# Altium project realPlantNursery.PrjPcb
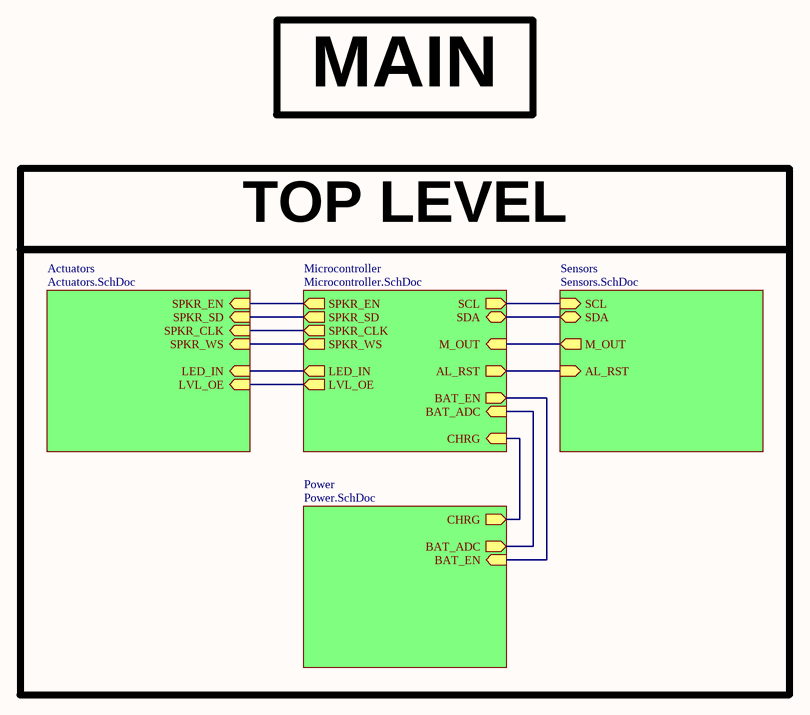
[diagram p0: Main.SchDoc]
5 sheets, 75 parts. Net scope: hierarchical (ports join the sheet entries above them; power ports are global).
Sheets:
  Main.SchDoc
    Microcontroller = Microcontroller.SchDoc
    Sensors = Sensors.SchDoc
    Actuators = Actuators.SchDoc
    Power = Power.SchDoc

## Sheet Main.SchDoc
size A; DocumentNumber: 1; SheetNumber: 1; SheetTotal: 5

### Parts
LOGO  SM Logo  [logo_10]  (value not drawn)  (no BOM)

### Sub-sheets
Actuators = Actuators.SchDoc: SPKR_EN (in), SPKR_SD (in), SPKR_CLK (in), SPKR_WS (in), LED_IN (in), LVL_OE (in)
Microcontroller = Microcontroller.SchDoc: SCL (out), SDA, M_OUT (in), CHRG (in), LVL_OE (out), LED_IN (out), SPKR_EN (out), SPKR_SD (out), SPKR_CLK (out), SPKR_WS (out), AL_RST (out), BAT_ADC (in), BAT_EN (out)
Power = Power.SchDoc: CHRG (out), BAT_ADC (out), BAT_EN (in)
Sensors = Sensors.SchDoc: SCL (in), SDA, AL_RST (in), M_OUT (out)

### Nets
AL_RST: sheet Microcontroller/AL_RST, sheet Sensors/AL_RST
BAT_ADC: sheet Microcontroller/BAT_ADC, sheet Power/BAT_ADC
BAT_EN: sheet Microcontroller/BAT_EN, sheet Power/BAT_EN
CHRG: sheet Microcontroller/CHRG, sheet Power/CHRG
LED_IN: sheet Microcontroller/LED_IN, sheet Actuators/LED_IN
LVL_OE: sheet Microcontroller/LVL_OE, sheet Actuators/LVL_OE
M_OUT: sheet Microcontroller/M_OUT, sheet Sensors/M_OUT
SCL: sheet Microcontroller/SCL, sheet Sensors/SCL
SDA: sheet Microcontroller/SDA, sheet Sensors/SDA
SPKR_CLK: sheet Microcontroller/SPKR_CLK, sheet Actuators/SPKR_CLK
SPKR_EN: sheet Microcontroller/SPKR_EN, sheet Actuators/SPKR_EN
SPKR_SD: sheet Microcontroller/SPKR_SD, sheet Actuators/SPKR_SD
SPKR_WS: sheet Microcontroller/SPKR_WS, sheet Actuators/SPKR_WS

### Notes on the sheet
- MAIN
- TOP LEVEL

### Library data of the parts
LOGO = smLogo

## Sheet Microcontroller.SchDoc
size A; DocumentNumber: 2; SheetNumber: 2; SheetTotal: 5
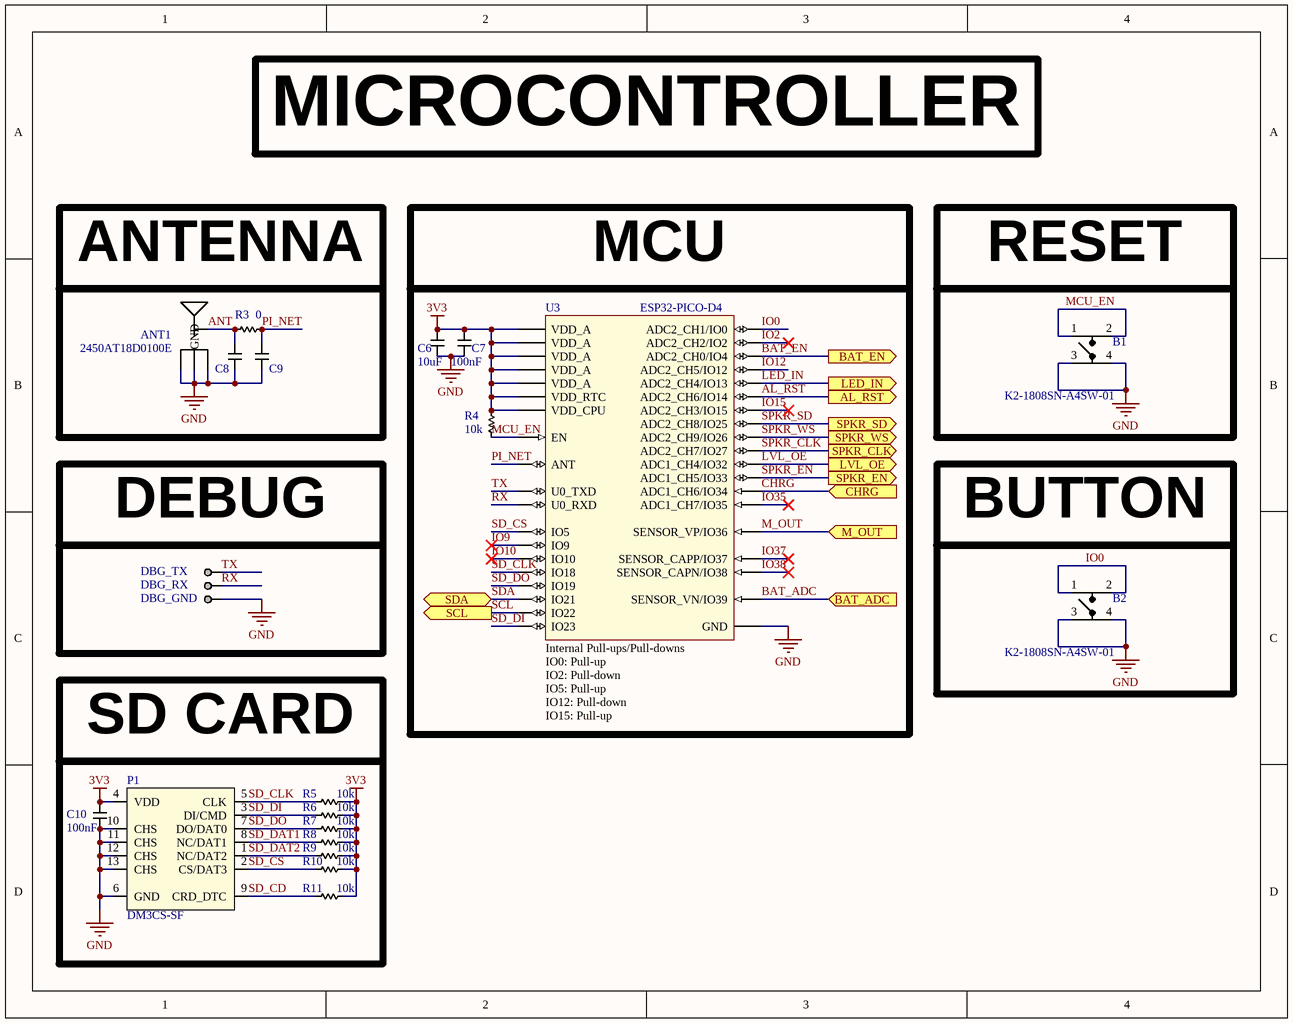
[diagram p1: Microcontroller.SchDoc]

### Parts
ANT1  2450AT18D0100E  [2450AT18D0100E_RH]
B1  K2-1808SN-A4SW-01  [K2-1808SN-A4SW-01]
B2  K2-1808SN-A4SW-01  [K2-1808SN-A4SW-01]
C6  10uF  [CAP_0603_HIGH]
C7  100nF  [CAP_0402_HIGH]
C8  C  [CAP_0402_HIGH]  (value not drawn)  (no BOM)
C9  C  [CAP_0402_HIGH]  (value not drawn)  (no BOM)
C10  100nF  [CAP_0402_HIGH]
DBG_GND  0.1" Header  [0.1" Header]  (value not drawn)  (no BOM)
DBG_RX  0.1" Header  [0.1" Header]  (value not drawn)  (no BOM)
DBG_TX  0.1" Header  [0.1" Header]  (value not drawn)  (no BOM)
P1  DM3CS-SF  [DM3CS-SF]
R3  0  [RES_0402_HIGH]
R4  10k  [RES_0402_HIGH]
R5  10k  [RES_0402_HIGH]
R6  10k  [RES_0402_HIGH]
R7  10k  [RES_0402_HIGH]
R8  10k  [RES_0402_HIGH]
R9  10k  [RES_0402_HIGH]
R10  10k  [RES_0402_HIGH]
R11  10k  [RES_0402_HIGH]
U3  ESP32-PICO-D4  [ESP32-PICO-D4]

### Ports
AL_RST (out), BAT_ADC (in), BAT_EN (out), CHRG (in), LED_IN (out), LVL_OE (out), M_OUT (in), SCL (out), SDA, SPKR_CLK (out), SPKR_EN (out), SPKR_SD (out), SPKR_WS (out)

### Nets
3V3: C6.2 C7.2 C10.2 P1.4(VDD) R4.2 R5.1 R6.1 R7.1 R8.1 R9.1 R10.1 R11.1 U3.1(VDD_A) U3.3(VDD_A) U3.4(VDD_A) U3.19(VDD_RTC) U3.37(VDD_CPU) U3.43(VDD_A) U3.46(VDD_A)
GND: ANT1.2(GND) ANT1.3(GND) ANT1.4(GND) B1.3 B1.4 B2.3 B2.4 C6.1 C7.1 C8.1 C9.1 C10.1 DBG_GND.1 P1.6(GND) P1.10(CHS) P1.11(CHS) P1.12(CHS) P1.13(CHS) U3.49(GND)
AL_RST: U3.17(ADC2_CH6/IO14) ; port AL_RST
ANT: ANT1.1(FEED) C8.2 R3.1
BAT_ADC: U3.8(SENSOR_VN/IO39) ; port BAT_ADC
BAT_EN: U3.24(ADC2_CH0/IO4) ; port BAT_EN
CHRG: U3.10(ADC1_CH6/IO34) ; port CHRG
IO0: B2.1 B2.2 U3.23(ADC2_CH1/IO0)
IO2: U3.22(ADC2_CH2/IO2)
IO9: U3.28(IO9)
IO10: U3.29(IO10)
IO12: U3.18(ADC2_CH5/IO12)
IO15: U3.21(ADC2_CH3/IO15)
IO35: U3.11(ADC1_CH7/IO35)
IO37: U3.6(SENSOR_CAPP/IO37)
IO38: U3.7(SENSOR_CAPN/IO38)
LED_IN: U3.20(ADC2_CH4/IO13) ; port LED_IN
LVL_OE: U3.12(ADC1_CH4/IO32) ; port LVL_OE
M_OUT: U3.5(SENSOR_VP/IO36) ; port M_OUT
MCU_EN: B1.1 B1.2 R4.1 U3.9(EN)
PI_NET: C9.2 R3.2 U3.2(ANT)
RX: DBG_RX.1 U3.40(U0_RXD)
SCL: U3.39(IO22) ; port SCL
SD_CD: P1.9(CRD_DTC) R11.2
SD_CLK: P1.5(CLK) R5.2 U3.35(IO18)
SD_CS: P1.2(CS/DAT3) R10.2 U3.34(IO5)
SD_DAT1: P1.8(NC/DAT1) R8.2
SD_DAT2: P1.1(NC/DAT2) R9.2
SD_DI: P1.3(DI/CMD) R6.2 U3.36(IO23)
SD_DO: P1.7(DO/DAT0) R7.2 U3.38(IO19)
SDA: U3.42(IO21) ; port SDA
SPKR_CLK: U3.16(ADC2_CH7/IO27) ; port SPKR_CLK
SPKR_EN: U3.13(ADC1_CH5/IO33) ; port SPKR_EN
SPKR_SD: U3.14(ADC2_CH8/IO25) ; port SPKR_SD
SPKR_WS: U3.15(ADC2_CH9/IO26) ; port SPKR_WS
TX: DBG_TX.1 U3.41(U0_TXD)

### Notes on the sheet
- MICROCONTROLLER
- ANTENNA
- MCU
- (near B1) RESET
- DEBUG
- (near B2) BUTTON
- SD CARD
- (in symbol ESP32-PICO-D4) Internal Pull-ups/Pull-downs / IO0: Pull-up / IO2: Pull-down / IO5: Pull-up / IO12: Pull-down / IO15: Pull-up /

### Library data of the parts
ANT1 = 2450AT18D0100E_RH: 2450AT18D0100E 2.4GHz  Chip RF Antenna 2.4GHz ~ 2.5GHz 1.5dBi Solder Surface Mount
B1 B2 = K2-1808SN-A4SW-01: K2-1808SN-A4SW-01 Tactile Switch SPST-NO Top Actuated Surface Mount
C6 = Capacitor_0603: 0603 Capacitor
C7-C10 = Capacitor_0402: 0402 Capacitor
P1 = DM3CS-SF: DM3CS-SF 10 (8 + 2) Position Card Connector Secure Digital - microSD™ Surface Mount, Right Angle Gold
R3-R11 = Resistor_0402: 0402 Resistor
U3 = ESP32-PICO-D4: ESP32-PICO-D4 SoC

## Sheet Sensors.SchDoc
size A; DocumentNumber: 3; SheetNumber: 3; SheetTotal: 5
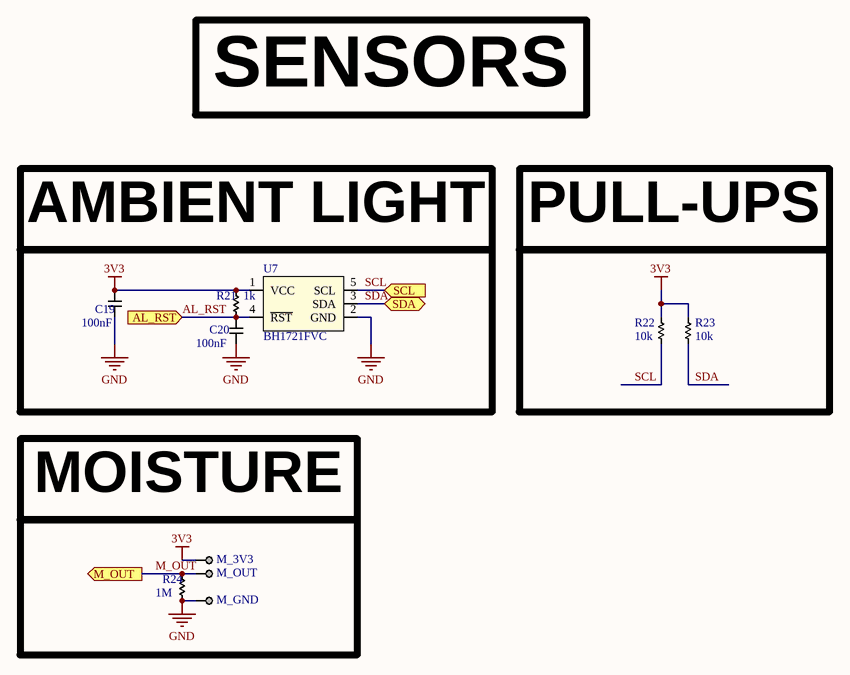
[diagram p2: Sensors.SchDoc]

### Parts
C19  100nF  [CAP_0402_HIGH]
C20  100nF  [CAP_0402_HIGH]
M_3V3  0.1" Header  [0.1" Header]  (value not drawn)  (no BOM)
M_GND  0.1" Header  [0.1" Header]  (value not drawn)  (no BOM)
M_OUT  0.1" Header  [0.1" Header]  (value not drawn)  (no BOM)
R21  1k  [RES_0402_HIGH]
R22  10k  [RES_0402_HIGH]
R23  10k  [RES_0402_HIGH]
R24  1M  [RES_0402_HIGH]
U7  BH1721FVC  [BH1721FVC]

### Ports
AL_RST (in), M_OUT (out), SCL (in), SDA

### Nets
3V3: C19.2 M_3V3.1 R21.2 R22.2 R23.2 U7.1(VCC)
GND: C19.1 C20.1 M_GND.1 R24.1 U7.2(GND)
AL_RST: C20.2 R21.1 U7.4(~{RST}) ; port AL_RST
M_OUT: M_OUT.1 R24.2 ; port M_OUT
SCL: R22.1 U7.5(SCL) ; port SCL
SDA: R23.1 U7.3(SDA) ; port SDA

### Notes on the sheet
- SENSORS
- AMBIENT LIGHT
- PULL-UPS
- MOISTURE

### Library data of the parts
C19 C20 = Capacitor_0402: 0402 Capacitor
R21-R24 = Resistor_0402: 0402 Resistor
U7 = BH1721FVC: BH1721FVC Optical Sensor Ambient 560nm I²C 5-SMD, Flat Leads

## Sheet Actuators.SchDoc
size A; DocumentNumber: 4; SheetNumber: 4; SheetTotal: 5
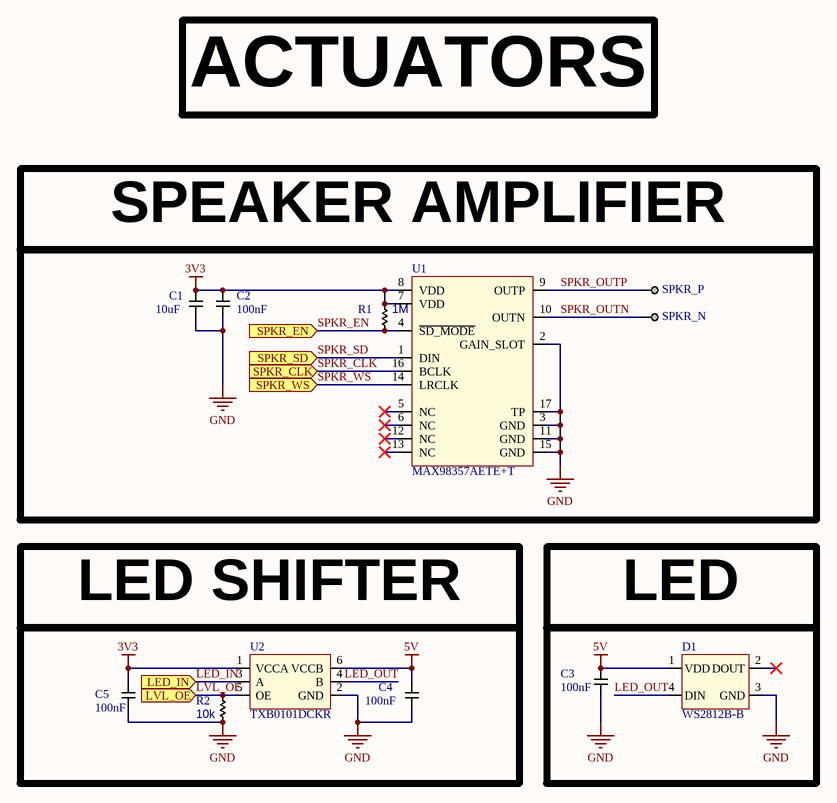
[diagram p3: Actuators.SchDoc]

### Parts
C1  10uF  [CAP_0603_HIGH]
C2  100nF  [CAP_0402_HIGH]
C3  100nF  [CAP_0402_HIGH]
C4  100nF  [CAP_0402_HIGH]
C5  100nF  [CAP_0402_HIGH]
D1  WS2812B-B  [WS2812B-B]
R1  1M  [RES_0402_HIGH]
R2  10k  [RES_0402_HIGH]
SPKR_N  0.1" Header  [0.1" Header]  (value not drawn)  (no BOM)
SPKR_P  0.1" Header  [0.1" Header]  (value not drawn)  (no BOM)
U1  MAX98357AETE+T  [MAX98357AETE+T]
U2  TXB0101DCKR  [TXB0101DCKR]

### Ports
LED_IN (in), LVL_OE (in), SPKR_CLK (in), SPKR_EN (in), SPKR_SD (in), SPKR_WS (in)

### Nets
3V3: C1.2 C2.2 C5.2 R1.2 U1.7(VDD) U1.8(VDD) U2.1(VCCA)
5V: C3.2 C4.2 D1.1(VDD) U2.6(VCCB)
GND: C1.1 C2.1 C3.1 C4.1 C5.1 D1.3(GND) R2.1 U1.2(GAIN_SLOT) U1.3(GND) U1.11(GND) U1.15(GND) U1.17(TP) U2.2(GND)
LED_IN: U2.3(A) ; port LED_IN
LED_OUT: D1.4(DIN) U2.4(B)
LVL_OE: R2.2 U2.5(OE) ; port LVL_OE
SPKR_CLK: U1.16(BCLK) ; port SPKR_CLK
SPKR_EN: R1.1 U1.4(~{SD_MODE}) ; port SPKR_EN
SPKR_OUTN: SPKR_N.1 U1.10(OUTN)
SPKR_OUTP: SPKR_P.1 U1.9(OUTP)
SPKR_SD: U1.1(DIN) ; port SPKR_SD
SPKR_WS: U1.14(LRCLK) ; port SPKR_WS

Not connected (* = marked no-connect by the designer): D1 2(DOUT)*; U1 5(NC)* 6(NC)* 12(NC)* 13(NC)*

### Notes on the sheet
- ACTUATORS
- SPEAKER AMPLIFIER
- LED SHIFTER
- LED

### Library data of the parts
C1 = Capacitor_0603: 0603 Capacitor
C2-C5 = Capacitor_0402: 0402 Capacitor
D1 = WS2812B-B: WS2812B-B RGB 620~630nm Red, 515~530nm Green, 465~475nm Blue SMD,5x5mm Light Emitting Diodes (LED) ROHS
R1 R2 = Resistor_0402: 0402 Resistor
U1 = MAX98357AETE+T: MAX98357AETE+T Amplifier IC 1-Channel (Mono) Class D 16-TQFN (3x3)
U2 = TXB0101DCKR: TXB0101DCKR Voltage Level Translator Bidirectional 1 Circuit 1 Channel 100Mbps SC-70-6

## Sheet Power.SchDoc
size A; DocumentNumber: 5; SheetNumber: 5; SheetTotal: 5
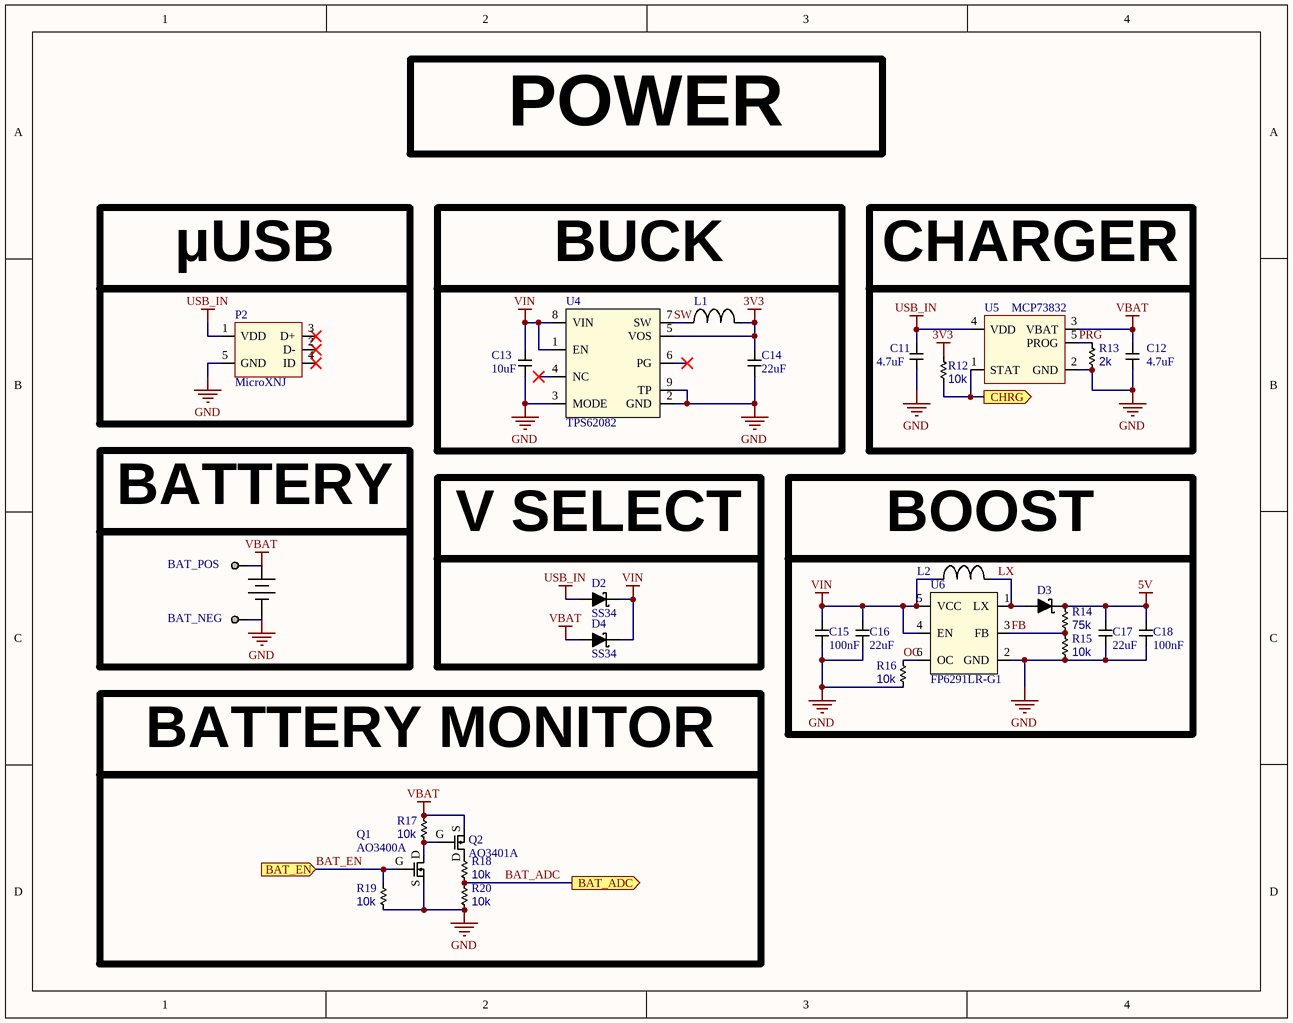
[diagram p4: Power.SchDoc]

### Parts
BAT_NEG  18 AWG Hole  [18 AWG Hole]  (value not drawn)  (no BOM)
BAT_POS  18 AWG Hole  [18 AWG Hole]  (value not drawn)  (no BOM)
C11  4.7uF  [CAP_0402_HIGH]
C12  4.7uF  [CAP_0402_HIGH]
C13  10uF  [CAP_0603_HIGH]
C14  22uF  [CAP_0603_HIGH]
C15  100nF  [CAP_0402_HIGH]
C16  22uF  [CAP_0603_HIGH]
C17  22uF  [CAP_0603_HIGH]
C18  100nF  [CAP_0402_HIGH]
D2  SS34  [SS34]
D3  SS34  [SS34]  (value not drawn)
D4  SS34  [SS34]
L1  YNR3015-2R2M  [YNR3015-2R2M]  (value not drawn)
L2  VLS3015ET-3R3M  [VLS3015ET-3R3M]  (value not drawn)
P2  MicroXNJ  [MicroXNJ]
Q1  AO3400A  [AO3400A]
Q2  AO3401A  [AO3401A]
R12  10k  [RES_0402_HIGH]
R13  2k  [RES_0402_HIGH]
R14  75k  [RES_0402_HIGH]
R15  10k  [RES_0402_HIGH]
R16  10k  [RES_0402_HIGH]
R17  10k  [RES_0402_HIGH]
R18  10k  [RES_0402_HIGH]
R19  10k  [RES_0402_HIGH]
R20  10k  [RES_0402_HIGH]
U4  TPS62082  [TPS62082]
U5  MCP73832  [MCP73831]
U6  FP6291LR-G1  [FP6291LR-G1]

### Ports
BAT_ADC (out), BAT_EN (in), CHRG (out)

### Nets
3V3: C14.2 L1.2 R12.1 U4.5(VOS)
5V: C17.2 C18.2 D3.2 R14.1
GND: BAT_NEG.1 C11.1 C12.1 C13.1 C14.1 C15.1 C16.1 C17.1 C18.1 P2.5(GND) Q1.S R13.2 R15.2 R16.2 R19.2 R20.2 U4.2(GND) U4.3(MODE) U4.9(TP) U5.2(GND) U6.2(GND)
USB_IN: C11.2 D2.1 P2.1(VDD) U5.4(VDD)
VBAT: BAT_POS.1 C12.2 D4.1 Q2.S R17.1 U5.3(VBAT)
VIN: C13.2 C15.2 C16.2 D2.2 D4.2 L2.1 U4.1(EN) U4.8(VIN) U6.4(EN) U6.5(VCC)
BAT_ADC: R18.2 R20.1 ; port BAT_ADC
BAT_EN: Q1.G R19.1 ; port BAT_EN
CHRG: R12.2 U5.1(STAT) ; port CHRG
FB: R14.2 R15.1 U6.3(FB)
LX: D3.1 L2.2 U6.1(LX)
OC: R16.1 U6.6(OC)
PRG: R13.1 U5.5(PROG)
SW: L1.1 U4.7(SW)
NetQ1_D: Q1.D Q2.G R17.2
NetQ2_D: Q2.D R18.1

Not connected (* = marked no-connect by the designer): P2 2(D-)* 3(D+)* 4(ID)*; U4 4(NC)* 6(PG)*

### Notes on the sheet
- POWER
- (near P2) μUSB
- BUCK
- CHARGER
- (near BAT_POS) BATTERY
- (near D2) V SELECT
- (near L2) BOOST
- BATTERY MONITOR

### Library data of the parts
C11 C12 C15 C18 = Capacitor_0402: 0402 Capacitor
C13 C14 C16 C17 = Capacitor_0603: 0603 Capacitor
D2-D4 = SS34: SS34 40V 3A 550mV @ 3A SMA(DO-214AC) Schottky Barrier Diodes (SBD) ROHS
L1 = YNR3015-2R2M: YNR3015-2R2M 2.2uH ±20% 1.6A 30mΩ SMD,3.0x3.0x1.5mm Power Inductors RoHS
L2 = VLS3015ET-3R3M: VLS3015ET-3R3M 3.3 µH Shielded Wirewound Inductor 1.15 A 112mOhm Max Nonstandard
P2 = MicroXNJ: MicroXNJ USB - micro B USB 2.0 Receptacle Connector 5 Position Surface Mount, Right Angle; Through Hole
Q1 = AO3400A: AO3400A N-Channel 30 V 5.7A (Ta) 1.4W (Ta) Surface Mount SOT-23-3
Q2 = AO3401A: AO3401A MOSFET P-CH 30V 4A SOT23
R12-R20 = Resistor_0402: 0402 Resistor
U4 = TPS62082: TPS62082 Buck Switching Regulator IC Positive Fixed 3.3V 1 Output 1.2A 8-WFDFN Exposed Pad
U5 = MCP73831: MCP73831 Charger IC Lithium-Ion/Polymer
U6 = FP6291LR-G1: FP6291LR-G1 2A 5.5V SOT-23-6 DC-DC Converters ROHS

## Nets that join several sheets
3V3: Microcontroller (19 pins), Sensors (6 pins), Actuators (7 pins), Power (C14.2 L1.2 R12.1 U4.5)
5V: Actuators (C3.2 C4.2 D1.1 U2.6), Power (C17.2 C18.2 D3.2 R14.1)
GND: Microcontroller (19 pins), Sensors (5 pins), Actuators (13 pins), Power (21 pins)
AL_RST: Microcontroller (U3.17), Sensors (C20.2 R21.1 U7.4)
BAT_ADC: Microcontroller (U3.8), Power (R18.2 R20.1)
BAT_EN: Microcontroller (U3.24), Power (Q1.G R19.1)
CHRG: Microcontroller (U3.10), Power (R12.2 U5.1)
LED_IN: Microcontroller (U3.20), Actuators (U2.3)
LVL_OE: Microcontroller (U3.12), Actuators (R2.2 U2.5)
M_OUT: Microcontroller (U3.5), Sensors (M_OUT.1 R24.2)
SCL: Microcontroller (U3.39), Sensors (R22.1 U7.5)
SDA: Microcontroller (U3.42), Sensors (R23.1 U7.3)
SPKR_CLK: Microcontroller (U3.16), Actuators (U1.16)
SPKR_EN: Microcontroller (U3.13), Actuators (R1.1 U1.4)
SPKR_SD: Microcontroller (U3.14), Actuators (U1.1)
SPKR_WS: Microcontroller (U3.15), Actuators (U1.14)